# EAGLE design vl6180x (EAGLE 7.1.0)
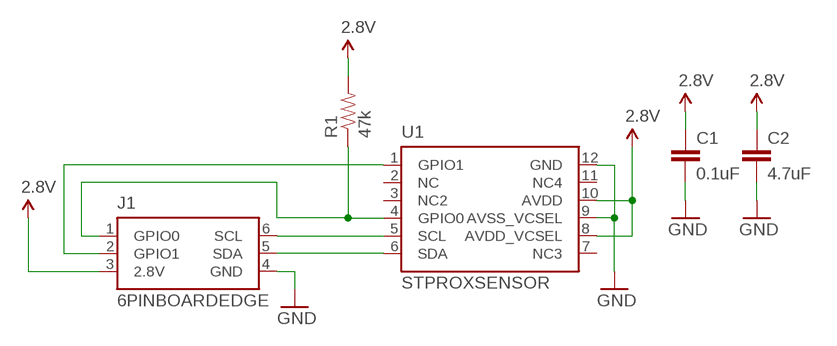
[diagram p0: schematic, sheet 1]

## Parts
C1  0.1uF  CAP0603-CAP  [0603-CAP]
C2  4.7uF  CAP0603-CAP  [0603-CAP]
J1  6PINBOARDEDGE  [6PINBOARDEDGE]
R1  47k  RESISTOR0603-RES  [0603-RES]
U1  STPROXSENSOR  [STPROXSENSOR]

## Nets
2.8V: C1.1 C2.1 J1.3(2.8V) R1.2 U1.8(AVDD_VCSEL) U1.10(AVDD)
GND: C1.2 C2.2 J1.4(GND) U1.9(AVSS_VCSEL) U1.12(GND)
N$1: J1.1(GPIO0) R1.1 U1.4(GPIO0)
N$2: J1.6(SCL) U1.5(SCL)
N$3: J1.5(SDA) U1.6(SDA)
N$4: J1.2(GPIO1) U1.1(GPIO1)
Unconnected: U1.2(NC) U1.3(NC2) U1.7(NC3) U1.11(NC4)

## Library data of the parts
C1 C2 = SparkFun-Passives:CAP: Capacitor Standard 0603 ceramic capacitor, and 0.1" leaded capacitor.
J1 = Nick'sEagle:6PINBOARDEDGE
R1 = SparkFun-Passives:RESISTOR: Resistor Basic schematic elements and footprints for 0603, 1206, and PTH resistors.
U1 = Nick'sEagle:STPROXSENSOR

## Board
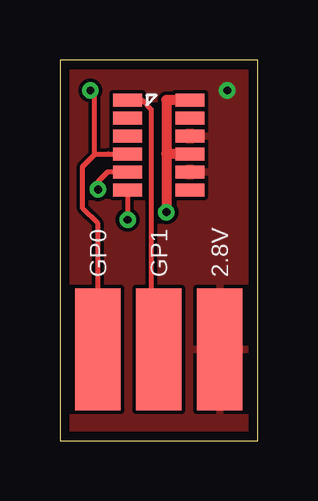
[diagram p1: board, top side]
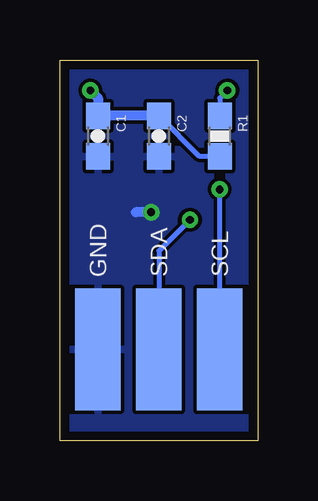
[diagram p2: board, bottom side, seen from below]

Size 8.26 x 15.88 mm. Coordinates in mm from the lower left corner, seen from the top.
Outline: 0,0 8.26,0 8.26,15.88 0,15.88 0,0
Copper layers (1*16): Top 0.0356mm / dielectric 1.5011mm / Bottom 0.0356mm
Design rules "LaenPCBOrder *": minimum track width 6mil, minimum drill 13mil, track to track 6mil, track to pad 6mil, pad to pad 6mil, via to via 6mil, smd to smd 6mil, copper to edge 15mil, drill to drill 6mil, minimum pad ring 7mil, minimum via ring 7mil, stop-mask expansion 3mil, vias tented up to drill 0mil, thermal gap 6mil

### Footprints (pad centres in the part's own frame; a part is rotated, then mirrored left to right if it is on the bottom)
0603-CAP = smd 1.1 x 1: 1 -0.85,0; 2 0.85,0
6PINBOARDEDGE = smd 1.905 x 5.08: 1 -2.54,0; 2 0,0; 3 2.54,0 | smd 1.905 x 5.08 bottom: 4 2.54,0; 5 0,0; 6 -2.54,0
0603-RES = smd 1.1 x 1: 1 -0.85,0; 2 0.85,0
STPROXSENSOR = smd 1.2 x 0.55: 1 -1.3,1.5; 2 -1.3,0.75; 3 -1.3,0; 4 -1.3,-0.75; 5 -1.3,-1.5; 6 -1.3,-2.25; 7 1.3,-2.25; 8 1.3,-1.5; 9 1.3,-0.75; 10 1.3,0; 11 1.3,0.75; 12 1.3,1.5

### Placement (x,y rotation side)
C1  6.67,12.7 270 bottom
C2  4.13,12.7 270 bottom
J1  4.13,3.81 0 top
R1  1.59,12.7 270 bottom
U1  4.13,12.7 0 top

### Tracks (layer width: path | path; a pad name or v marks a point on that pad's centre or on a via)
2.8V  (via drill 0.33)
  Bottom 0.203: R1.2 2.43,11.85 C2.1
  Bottom 0.406: C2.1 C1.1 6.67,14.29 v6.99,14.61
  pour Top: 0,0 8.26,0 8.26,15.88 0,15.88
GND  (via drill 0.33)
  Top 0.406: U1.9 4.45,11.95 | 4.45,11.95 v4.45,9.53 | U1.12 4.45,14.2 4.45,11.95
  Bottom 0.406: v4.45,9.53 5.08,9.53
  pour Bottom: 0,0 8.26,0 8.26,15.88 0,15.88
N$1  (via drill 0.33)
  Top 0.203: 2.02,11.95 U1.4 1.47,11.95 1.43,11.91 | 1.43,11.91 0.95,11.43 0.95,9.68 1.59,9.05 J1.1 | v1.27,14.61 1.43,14.45 1.43,11.91
  Bottom 0.203: v1.27,14.61 1.59,14.29 R1.1
N$2  (via drill 0.33)
  Top 0.203: U1.5 1.99,11.2 1.59,10.79 v1.59,10.48
  Bottom 0.203: J1.6 v1.59,10.48
N$3  (via drill 0.33)
  Top 0.203: U1.6 v2.83,9.21
  Bottom 0.203: v2.83,9.21 4.13,7.91 J1.5
N$4
  Top 0.203: U1.1 3.42,14.2 3.81,13.81 3.81,5.24 J1.2

### Text on the board
tPlace: GP0 | GP1 | 2.8V
bPlace: SCL | SDA | GND